# EasyEDA schematic 1-Schematic_Levitator v2.json

## Sheets
1 Bottom PCB: TITLE: Bottom PCB; REV: 2.0; Date: 2024-05-14; Sheet: 1/1; Drawn By: tecknet; Company: tecknet.gg
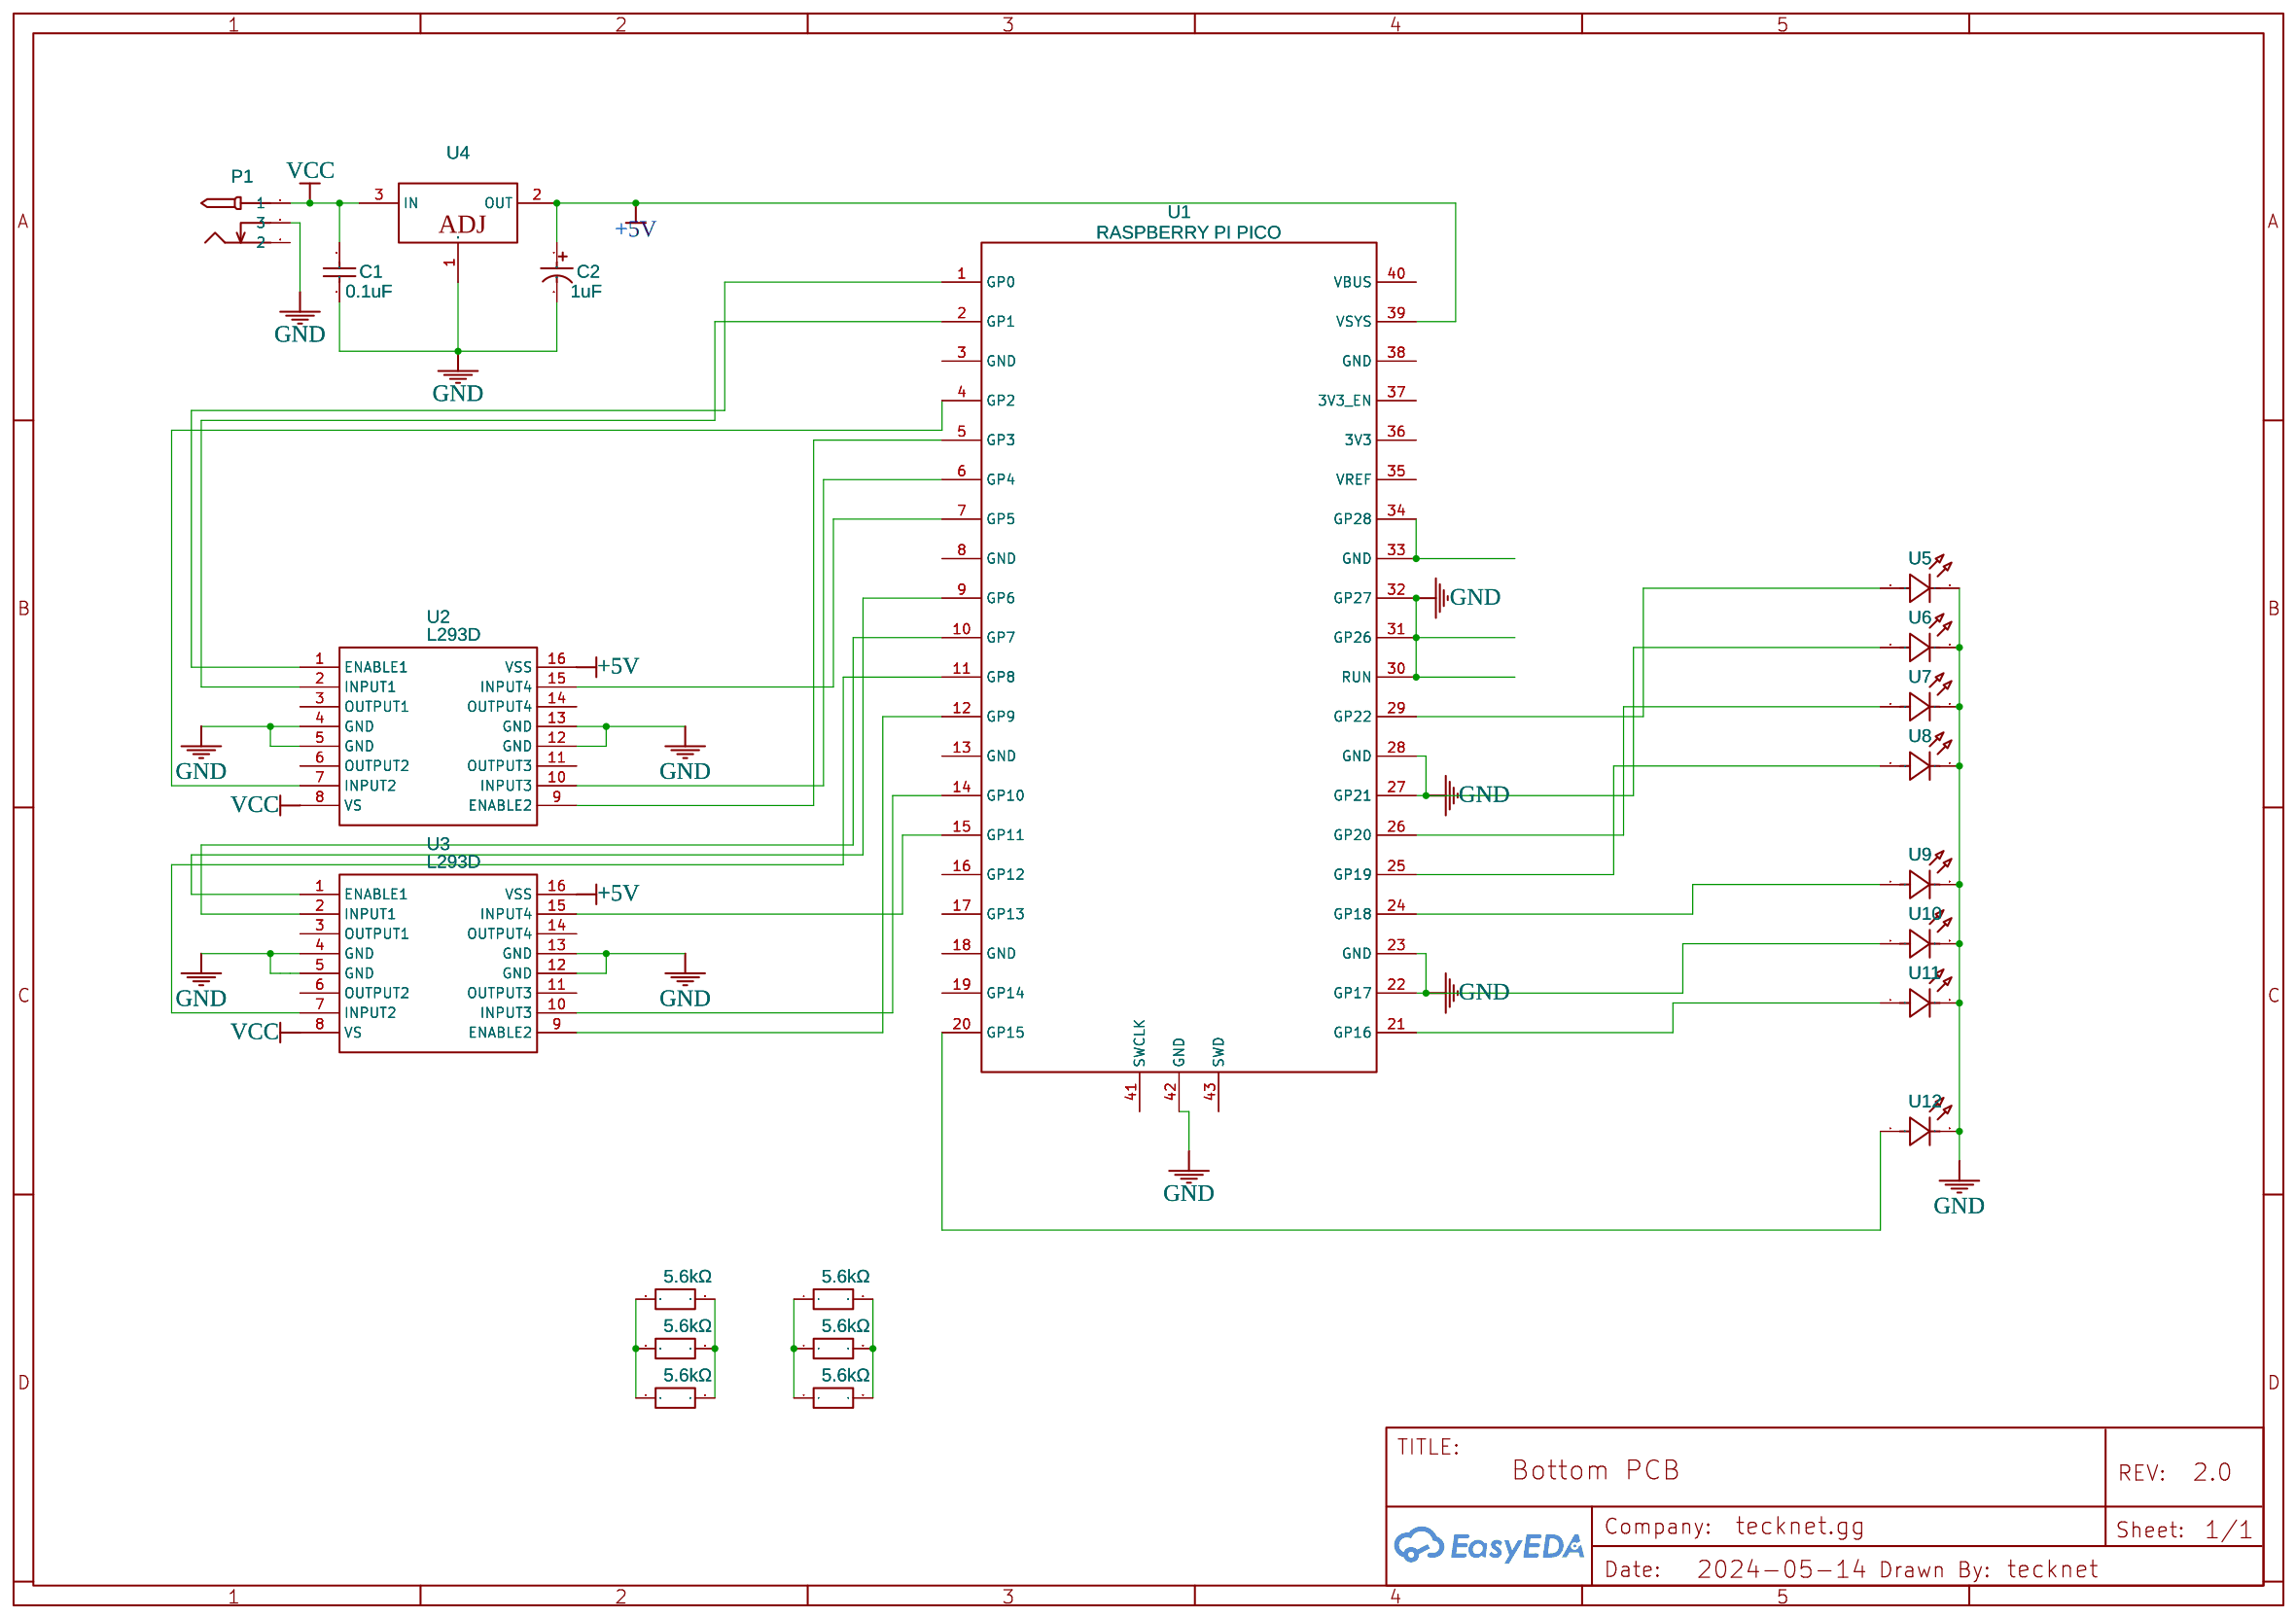
[diagram p0: Bottom PCB]
2 Sheet_1: TITLE: Sheet_1; REV: 1.0; Date: 2024-08-23; Drawn By: Tecknet; Company: Your Company
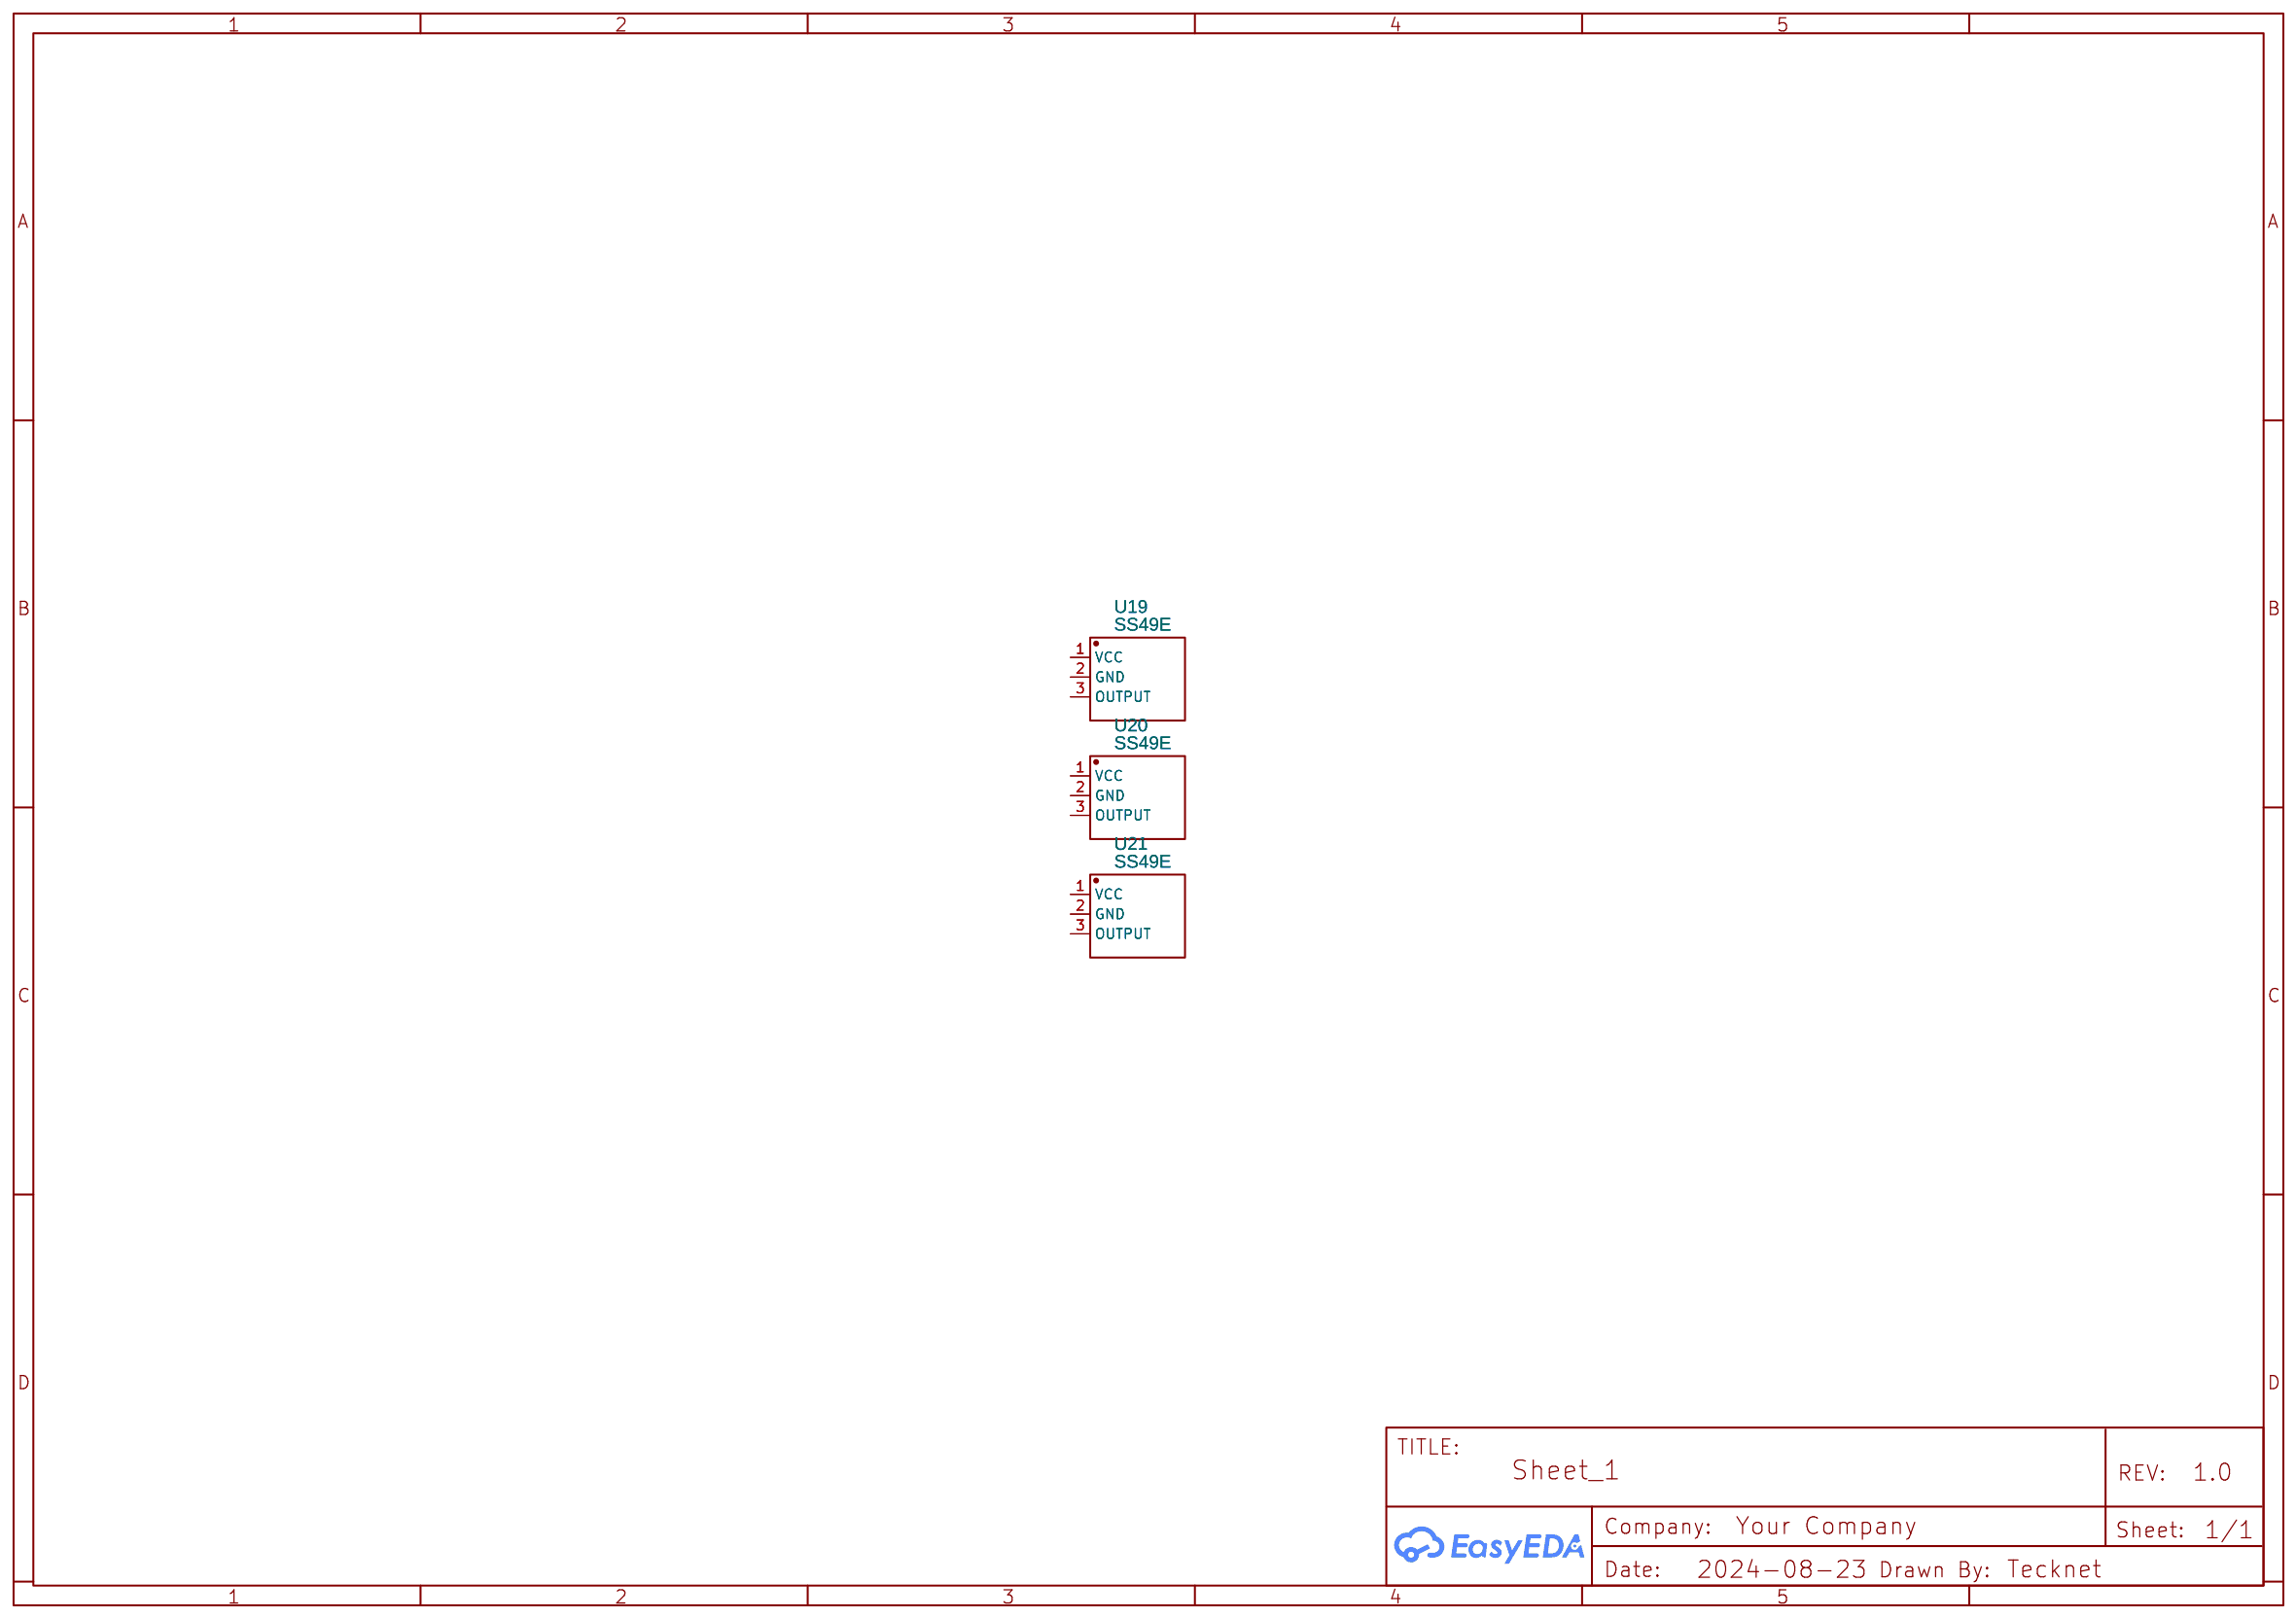
[diagram p1: Sheet_1]

## Parts
sheet Bottom PCB
C1  0.1uF  [2.5MM CERAMIC CAP]
C2  1uF  [CAPACITOR, 2.54MM PIN CAPACITOR]
P1  BARREL POWER JACK 2.1MM  [BARREL POWER JACK 2.1MM]
U1  RASPBERRY PI PICO  [PICO_FOOTPRINT_BY_HIMESH]
U2  L293D  [DIP-16_L20.0-W6.4-P2.54-LS7.6-BL]
U3  L293D  [DIP-16_L20.0-W6.4-P2.54-LS7.6-BL]
U4  LM317T_C2976492  [PG-TO220-3_L10.0-W4.4-P2.54-L]
U5  L240CTZ0G3MM  [LED-TH_BD3.8-P2.54_L240CTZ0G3MM]
U6  L240CTZ0G3MM  [LED-TH_BD3.8-P2.54_L240CTZ0G3MM]
U7  L240CTZ0G3MM  [LED-TH_BD3.8-P2.54_L240CTZ0G3MM]
U8  L240CTZ0G3MM  [LED-TH_BD3.8-P2.54_L240CTZ0G3MM]
U9  L240CTZ0G3MM  [LED-TH_BD3.8-P2.54_L240CTZ0G3MM]
U10  L240CTZ0G3MM  [LED-TH_BD3.8-P2.54_L240CTZ0G3MM]
U11  L240CTZ0G3MM  [LED-TH_BD3.8-P2.54_L240CTZ0G3MM]
U12  L240CTZ0G3MM  [LED-TH_BD3.8-P2.54_L240CTZ0G3MM]
U13  5.6kΩ  [RES-TH_BD2.3-L6.0-P10.00-D0.4]
U14  5.6kΩ  [RES-TH_BD2.3-L6.0-P10.00-D0.4]
U15  5.6kΩ  [RES-TH_BD2.3-L6.0-P10.00-D0.4]
U16  5.6kΩ  [RES-TH_BD2.3-L6.0-P10.00-D0.4]
U17  5.6kΩ  [RES-TH_BD2.3-L6.0-P10.00-D0.4]
U18  5.6kΩ  [RES-TH_BD2.3-L6.0-P10.00-D0.4]
sheet Sheet_1
U19  SS49E  [TO-92S_3P-L4.1-W1.6-P1.27-L]
U20  SS49E  [TO-92S_3P-L4.1-W1.6-P1.27-L]
U21  SS49E  [TO-92S_3P-L4.1-W1.6-P1.27-L]

## Library data of the parts
C1 = CERAMIC CAPACITOR 100NF: Supplier Part: undefined; Supplier: LCSC; Manufacturer: LCSC; Manufacturer Part: CT4-0805Y104M500; Contributor: firstking; Package Display: No
C2 = 1uF 400V 6.3*12: Supplier: LCSC; Manufacturer: CX(承兴); Manufacturer Part: KM105M400E12RR0VH2FP0; Supplier Part: C46093; JLCPCB Part Class: Extended Part; Package Display: No
P1 = BARREL POWER JACK 2.1MM: Supplier: Reichelt; Contributor: Jan-Haase18
U1 = RASPBERRY PI PICO: Manufacturer Part: Raspberry Pi Pico; Contributor: monika1
U2 U3 = L293D: Contributor: pitreluc; Supplier: LCSC; Manufacturer: ST(意法半导体); Supplier Part: C12340; JLCPCB Part Class: Extended Part
U4 = LM317T_C2976492: Contributor: LCSC; Supplier: LCSC; Supplier Part: C2976492; Manufacturer: ISC(无锡固电); Manufacturer Part: LM317T; JLCPCB Part Class: Extended Part
U5-U12 = L240CTZ0G3MM: Supplier: LCSC; Supplier Part: C9900093286; Manufacturer: null; Contributor: lcsc; JLCPCB Part Class: Extended Part
U13-U18 = CF14JT5K60: Contributor: lcsc; Supplier: LCSC; Supplier Part: C2441451; Manufacturer: SEI(Stackpole Electronics Inc.); JLCPCB Part Class: Extended Part
U19-U21 = SS49E: Contributor: LCSC; Supplier: LCSC; Manufacturer: Honeywell(霍尼韦尔); Supplier Part: C85697; JLCPCB Part Class: Extended Part

## Nets
+5V: C2.1 U1.39(VSYS) U2.16(VSS) U3.16(VSS) U4.2(OUT)
GND: C1.1 C2.2 P1.3 U1.22(GP17) U1.23(GND) U1.27(GP21) U1.28(GND) U1.30(RUN) U1.31(GP26) U1.32(GP27) U1.42(GND) U2.4(GND) U2.5(GND) U2.12(GND) U2.13(GND) U3.4(GND) U3.5(GND) U3.12(GND) U3.13(GND) U4.1(ADJ) U5.2(K) U6.1(A) U6.2(K) U7.2(K) U8.2(K) U9.2(K) U10.1(A) U10.2(K) U11.2(K) U12.2(K)
VCC: C1.2 P1.1 U2.8(VS) U3.8(VS) U4.3(IN)
Net-(U1-1): U1.1(GP0) U2.1(ENABLE1)
Net-(U1-2): U1.2(GP1) U2.2(INPUT1)
Net-(U1-4): U1.4(GP2) U2.7(INPUT2)
Net-(U1-5): U1.5(GP3) U2.9(ENABLE2)
Net-(U1-6): U1.6(GP4) U2.10(INPUT3)
Net-(U1-7): U1.7(GP5) U2.15(INPUT4)
Net-(U1-9): U1.9(GP6) U3.1(ENABLE1)
Net-(U1-10): U1.10(GP7) U3.2(INPUT1)
Net-(U1-11): U1.11(GP8) U3.7(INPUT2)
Net-(U1-12): U1.12(GP9) U3.9(ENABLE2)
Net-(U1-14): U1.14(GP10) U3.10(INPUT3)
Net-(U1-15): U1.15(GP11) U3.15(INPUT4)
Net-(U1-20): U1.20(GP15) U12.1(A)
Net-(U1-21): U1.21(GP16) U11.1(A)
Net-(U1-24): U1.24(GP18) U9.1(A)
Net-(U1-25): U1.25(GP19) U8.1(A)
Net-(U1-26): U1.26(GP20) U7.1(A)
Net-(U1-29): U1.29(GP22) U5.1(A)
Net-(U1-33): U1.33(GND) U1.34(GP28)
Net-(U13-1): U13.1 U14.1 U15.1
Net-(U13-2): U13.2 U14.2 U15.2
Net-(U16-1): U16.1 U17.1 U18.1
Net-(U16-2): U16.2 U17.2 U18.2

Not connected (* = marked no-connect by the designer): P1 2; U1 3(GND) 8(GND) 13(GND) 16(GP12) 17(GP13) 18(GND) 19(GP14) 35(VREF) 36(3V3) 37(3V3_EN) 38(GND) 40(VBUS) 41(SWCLK) 43(SWD); U2 3(OUTPUT1) 6(OUTPUT2) 11(OUTPUT3) 14(OUTPUT4); U3 3(OUTPUT1) 6(OUTPUT2) 11(OUTPUT3) 14(OUTPUT4); U19 1(VCC) 2(GND) 3(OUTPUT); U20 1(VCC) 2(GND) 3(OUTPUT); U21 1(VCC) 2(GND) 3(OUTPUT)
